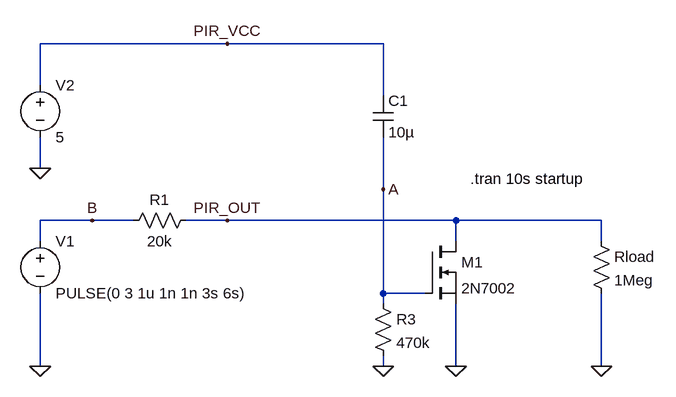
[diagram p0: schematic design1.asc]
design1.asc, the LTspice schematic file:
Version 4
SHEET 1 880 680
WIRE -16 -160 -304 -160
WIRE 224 -160 -16 -160
WIRE -304 -96 -304 -160
WIRE 224 -80 224 -160
WIRE -304 32 -304 -16
WIRE 224 64 224 -16
WIRE -224 112 -304 112
WIRE -160 112 -224 112
WIRE -16 112 -80 112
WIRE 336 112 -16 112
WIRE 560 112 336 112
WIRE -304 144 -304 112
WIRE 336 144 336 112
WIRE 560 144 560 112
WIRE 224 224 224 64
WIRE 288 224 224 224
WIRE 224 240 224 224
WIRE -304 336 -304 224
WIRE 224 336 224 320
WIRE 336 336 336 240
WIRE 560 336 560 224
FLAG -304 336 0
FLAG -304 32 0
FLAG 560 336 0
FLAG 336 336 0
FLAG 224 336 0
FLAG -16 112 PIR_OUT
FLAG -16 -160 PIR_VCC
FLAG 224 64 A
FLAG -224 112 B
SYMBOL voltage -304 128 R0
WINDOW 123 0 0 Left 0
WINDOW 39 0 0 Left 0
SYMATTR InstName V1
SYMATTR Value PULSE(0 3 1u 1n 1n 3s 6s)
SYMBOL voltage -304 -112 R0
WINDOW 123 0 0 Left 0
WINDOW 39 0 0 Left 0
SYMATTR InstName V2
SYMATTR Value 5
SYMBOL res -64 96 R90
WINDOW 0 0 56 VBottom 2
WINDOW 3 32 56 VTop 2
SYMATTR InstName R1
SYMATTR Value 20k
SYMBOL res 544 128 R0
SYMATTR InstName Rload
SYMATTR Value 1Meg
SYMBOL nmos 288 144 R0
SYMATTR InstName M1
SYMATTR Value 2N7002
SYMBOL cap 208 -80 R0
SYMATTR InstName C1
SYMATTR Value 10µ
SYMBOL res 208 224 R0
SYMATTR InstName R3
SYMATTR Value 470k
TEXT 358 48 Left 2 !.tran 10s startup

The netlist it stands for:
* design1.asc
V1 B 0 PULSE(0 3 1u 1n 1n 3s 6s)
V2 PIR_VCC 0 5
R1 PIR_OUT B 20k
Rload PIR_OUT 0 1Meg
M1 PIR_OUT A 0 0 2N7002
C1 PIR_VCC A 10µ
R3 A 0 470k
.model NMOS NMOS
.model PMOS PMOS
.lib standard.mos
.tran 10s startup
.backanno
.end